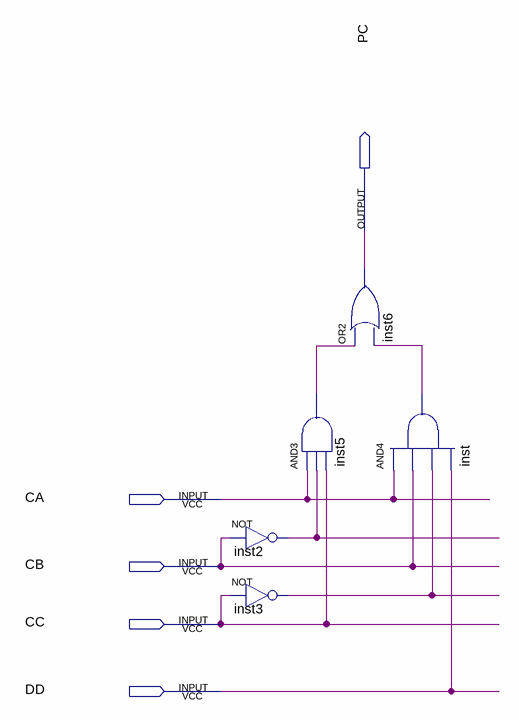
[diagram p0: schematic sheet]
// Quartus schematic ColunaC.bdf as structural Verilog: 5 symbols, 5 pins
module ColunaC (
  input  CA,
  input  CB,
  input  CC,
  input  DD,
  output PC
);

  wire inst2_out, inst3_out, inst5_out, inst_out;

  not inst2 (inst2_out, CB);
  not inst3 (inst3_out, CC);
  or inst6 (PC, inst5_out, inst_out);
  and inst5 (inst5_out, CA, inst2_out, CC);
  and inst (inst_out, CA, CB, inst3_out, DD);
endmodule
